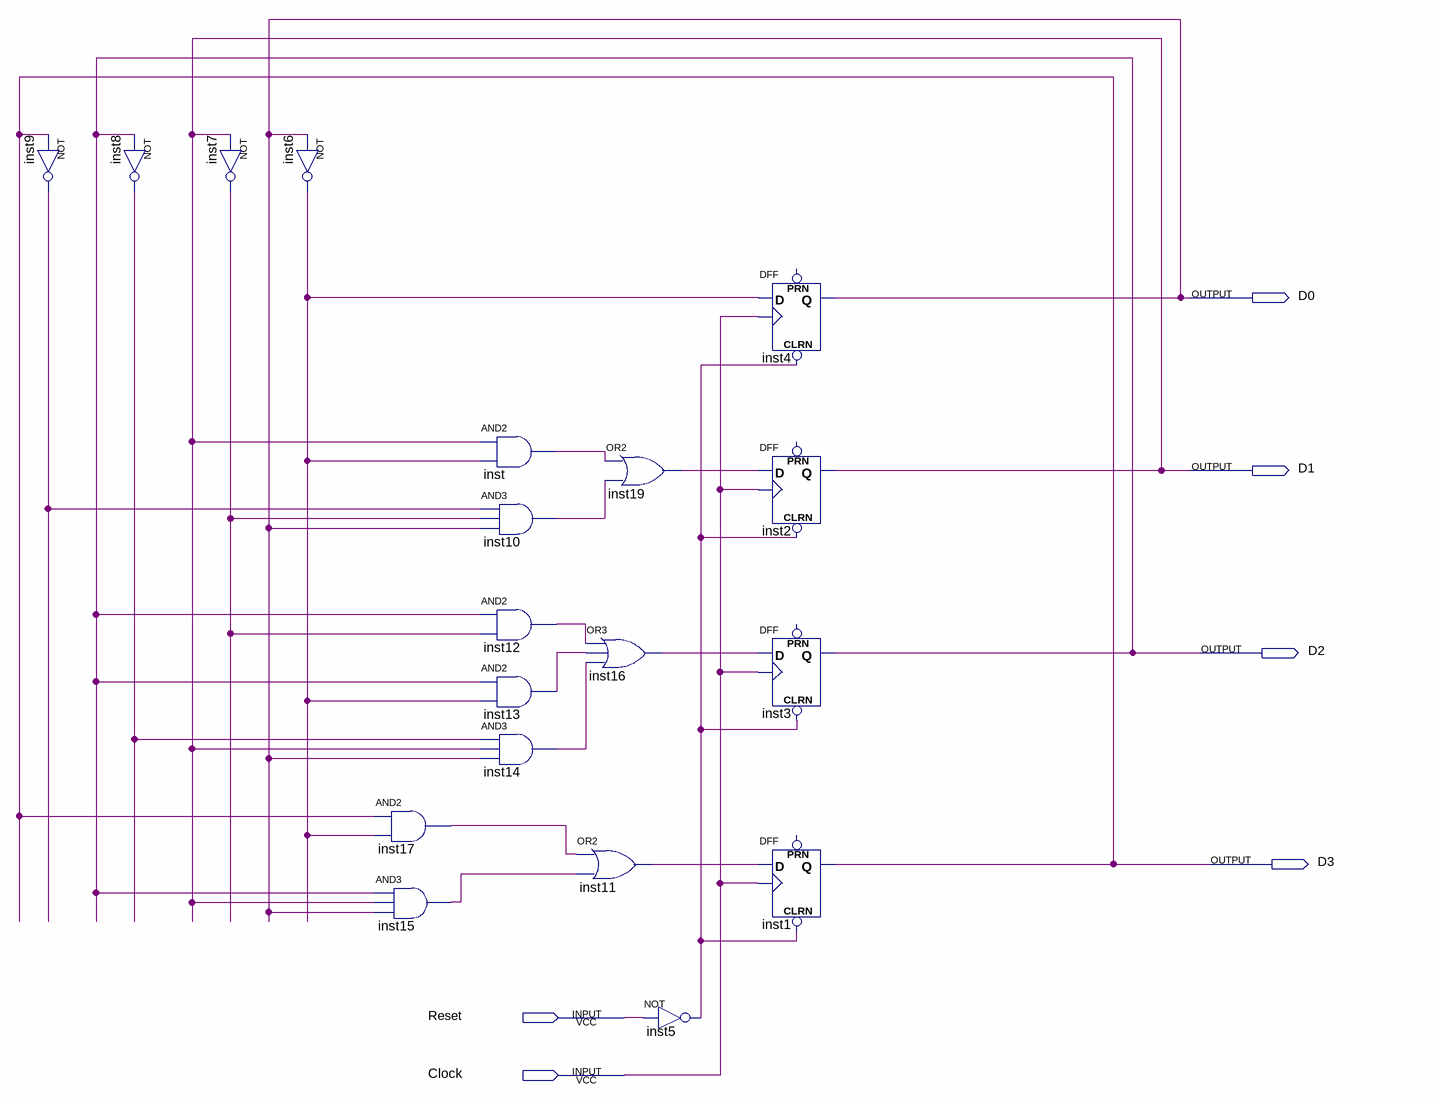
[diagram p0: schematic sheet]
// Quartus schematic BCDCounter.bdf as structural Verilog: 19 symbols, 6 pins
module BCDCounter (
  input  Reset,
  input  Clock,
  output D0,
  output D1,
  output D2,
  output D3
);

  wire inst5_out, inst6_out, inst7_out, inst8_out, inst9_out, inst10_out, inst11_out, inst12_out, inst13_out,
       inst14_out, inst15_out, inst16_out, inst17_out, inst19_out, inst_out;

  not inst9 (inst9_out, D3);
  not inst8 (inst8_out, D2);
  not inst7 (inst7_out, D1);
  not inst6 (inst6_out, D0);
  and inst17 (inst17_out, D3, inst6_out);
  and inst15 (inst15_out, D2, D1, D0);
  and inst (inst_out, D1, inst6_out);
  and inst10 (inst10_out, inst9_out, inst7_out, D0);
  and inst12 (inst12_out, D2, inst7_out);
  and inst13 (inst13_out, D2, inst6_out);
  and inst14 (inst14_out, inst8_out, D1, D0);
  or inst19 (inst19_out, inst_out, inst10_out);
  or inst16 (inst16_out, inst12_out, inst13_out, inst14_out);
  or inst11 (inst11_out, inst17_out, inst15_out);
  not inst5 (inst5_out, Reset);
  DFF inst4 (.CLRN(inst5_out), .CLK(Clock), .D(inst6_out), .Q(D0));  // open: PRN
  DFF inst2 (.CLRN(inst5_out), .CLK(Clock), .D(inst19_out), .Q(D1));  // open: PRN
  DFF inst3 (.CLRN(inst5_out), .CLK(Clock), .D(inst16_out), .Q(D2));  // open: PRN
  DFF inst1 (.CLRN(inst5_out), .CLK(Clock), .D(inst11_out), .Q(D3));  // open: PRN
endmodule
